# Altium schematic sheet Schematic QUO-Remote.schdoc
size 429 x 306 mm
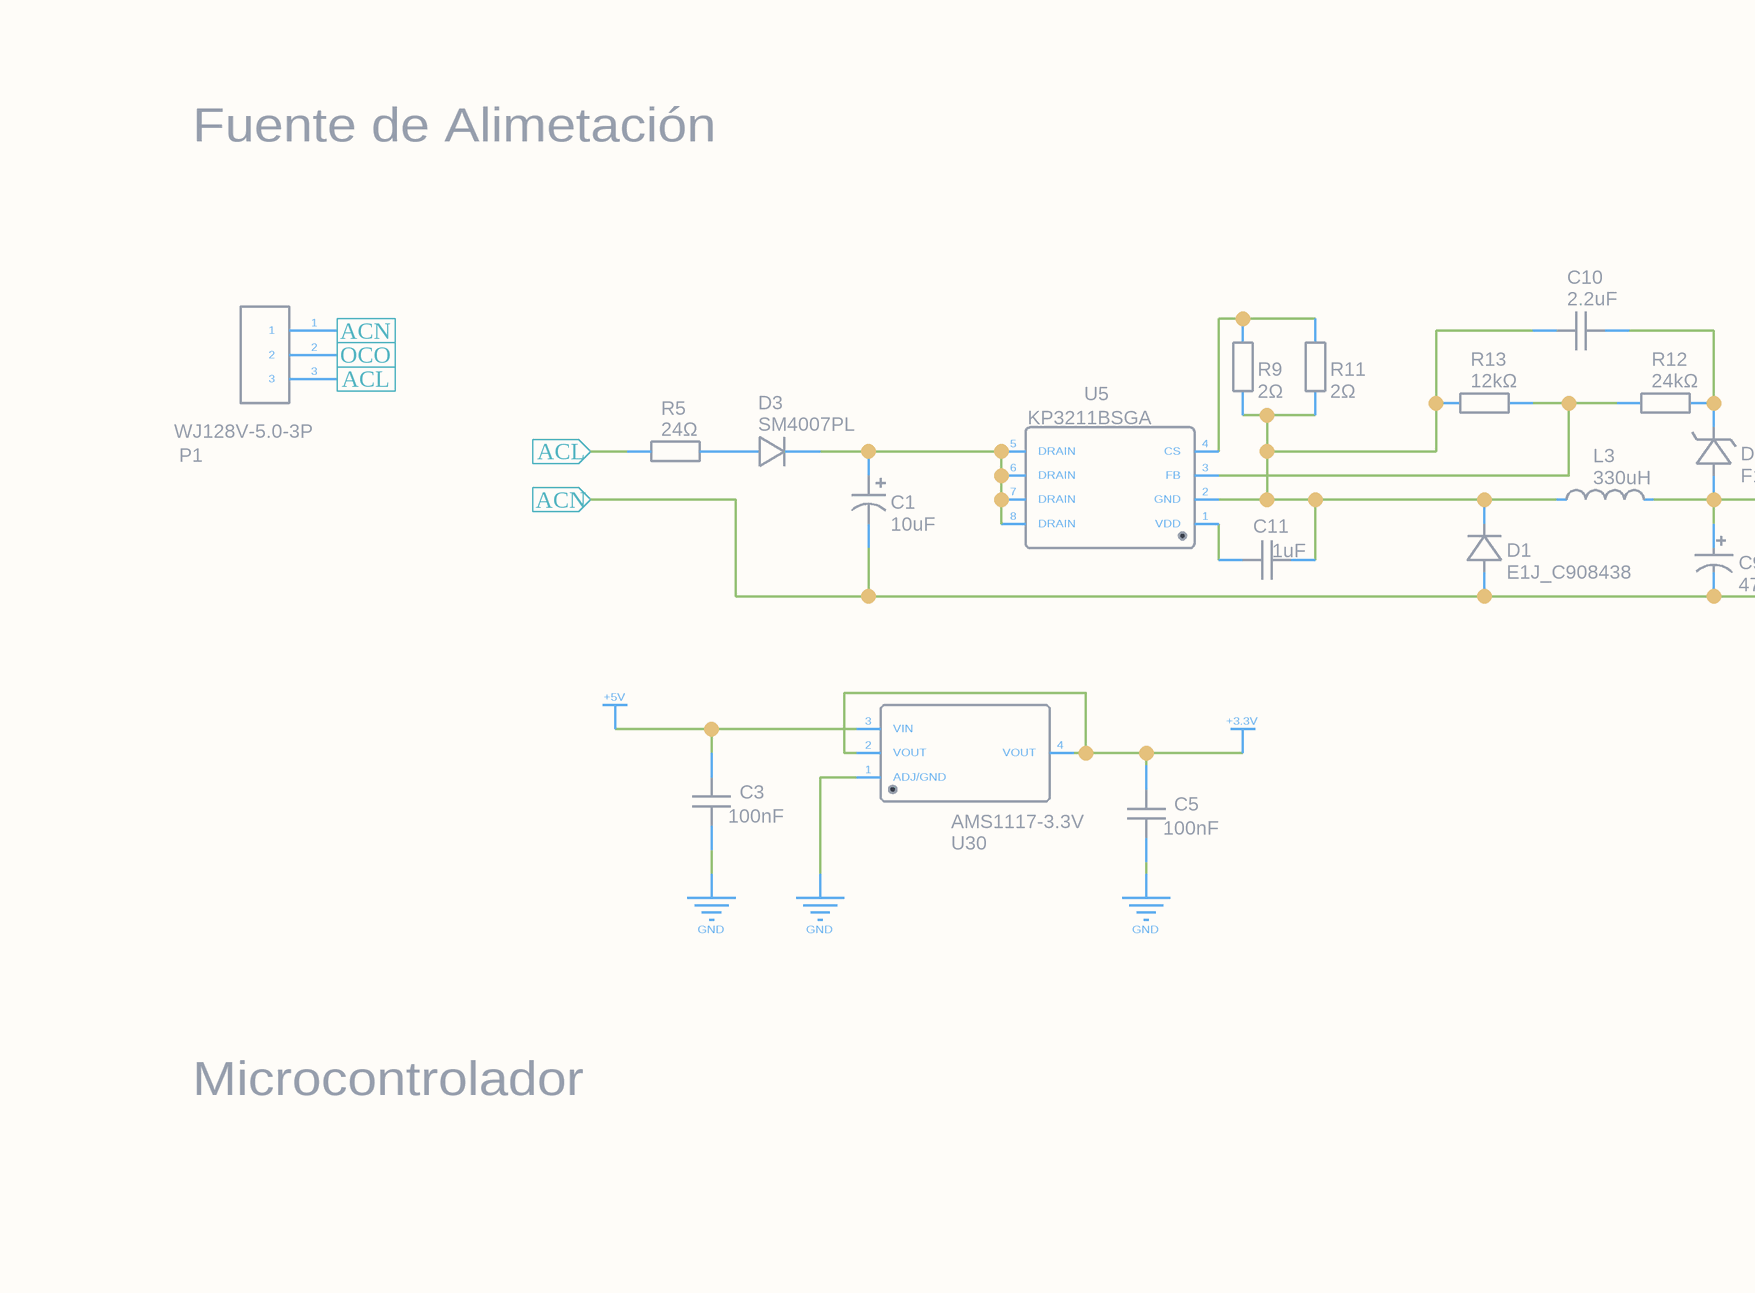
[diagram p0: Schematic QUO-Remote.schdoc, top left]
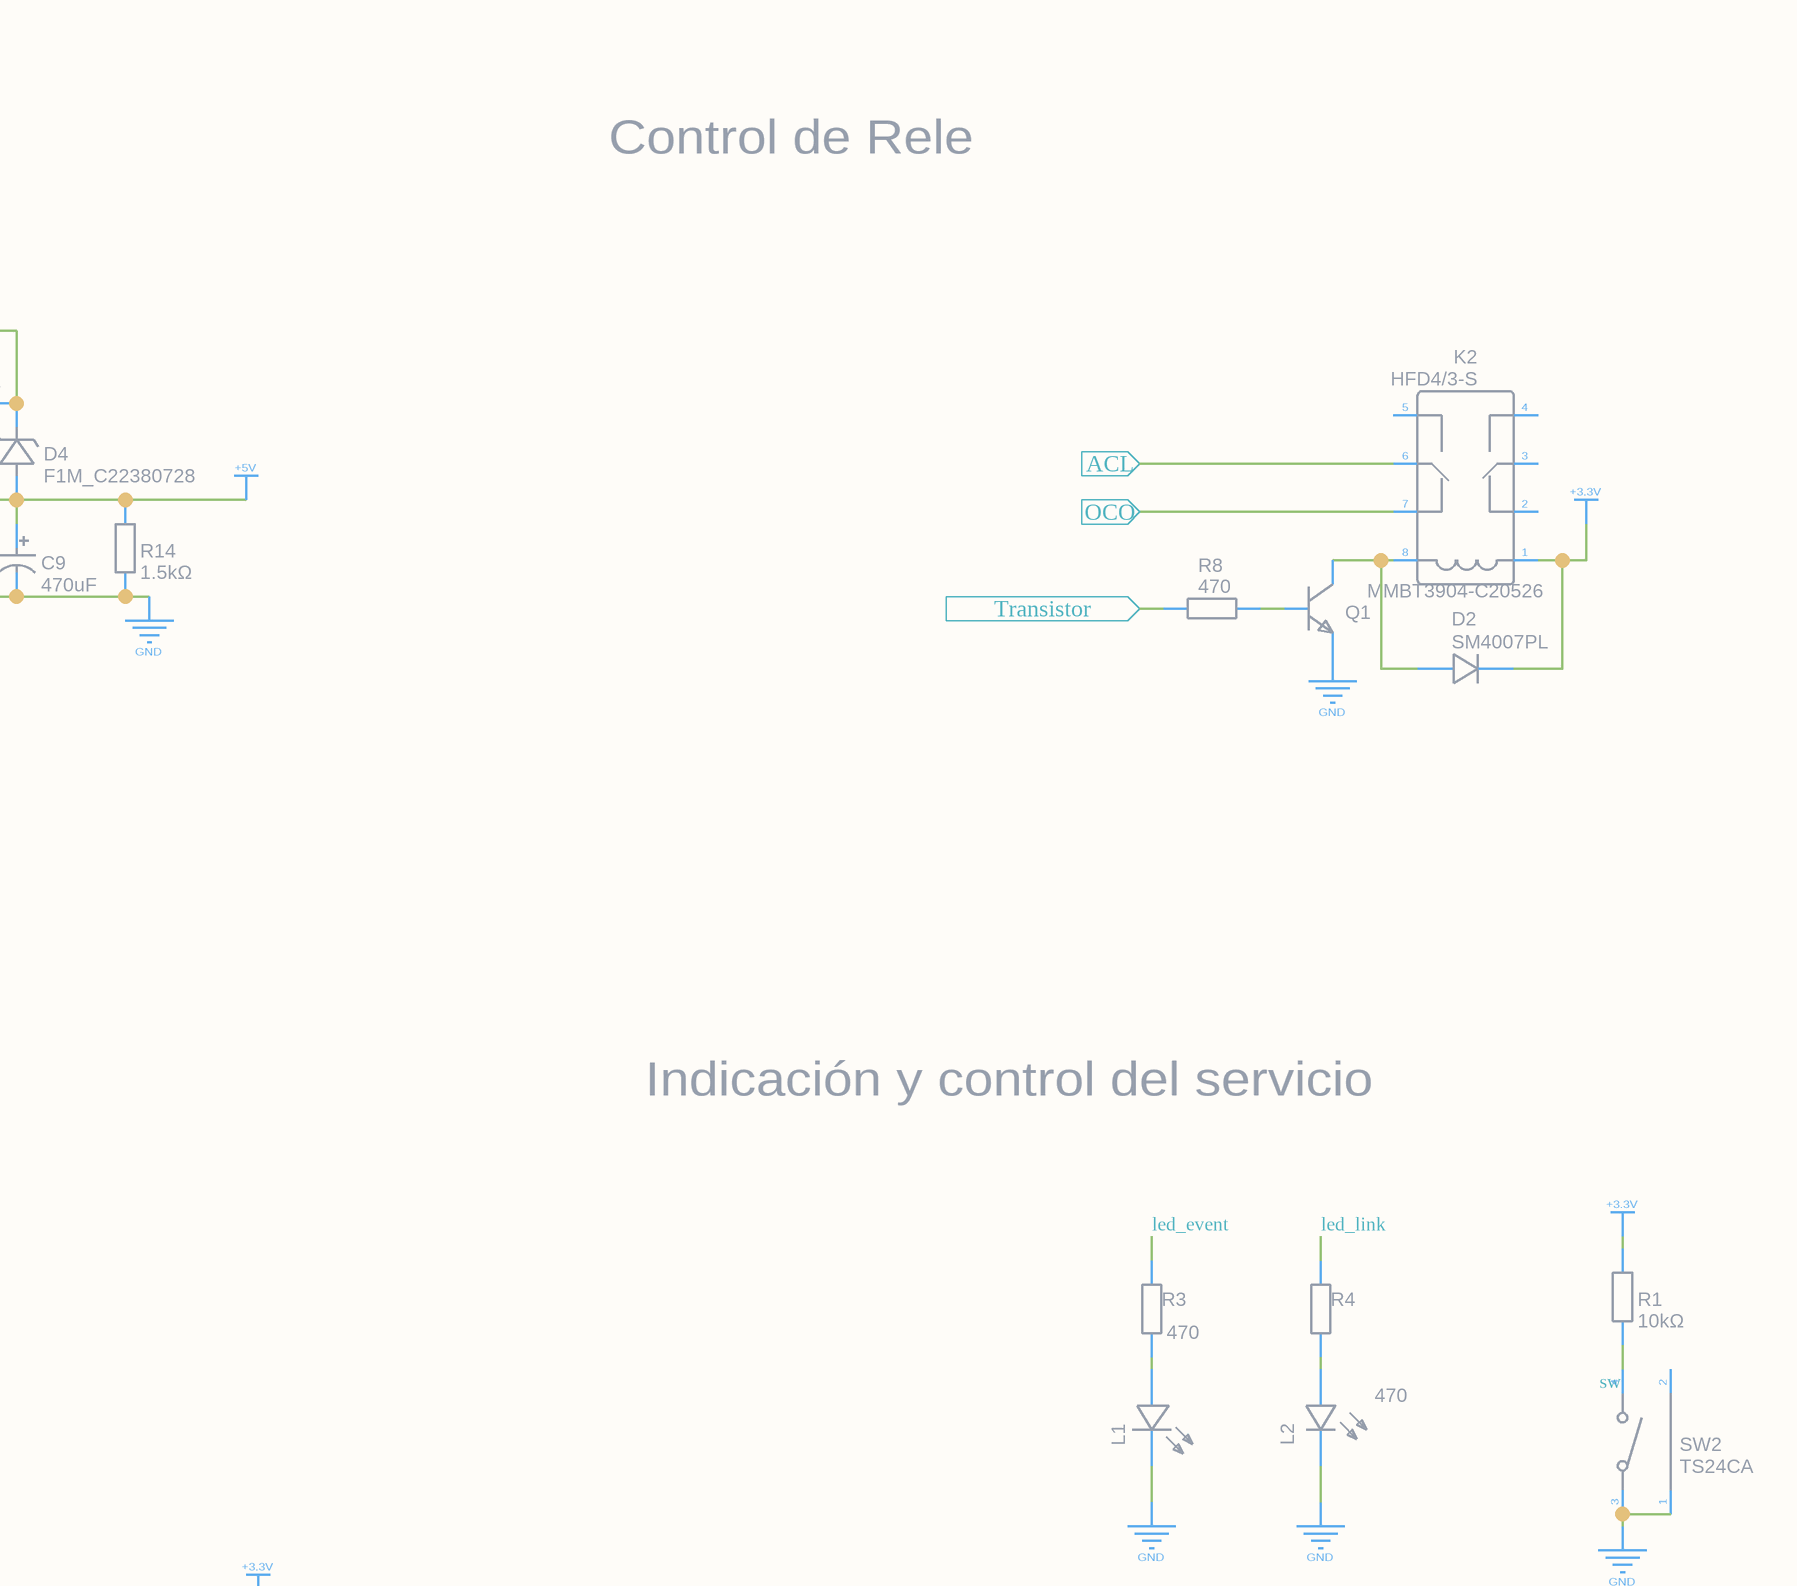
[diagram p1: Schematic QUO-Remote.schdoc, top middle]
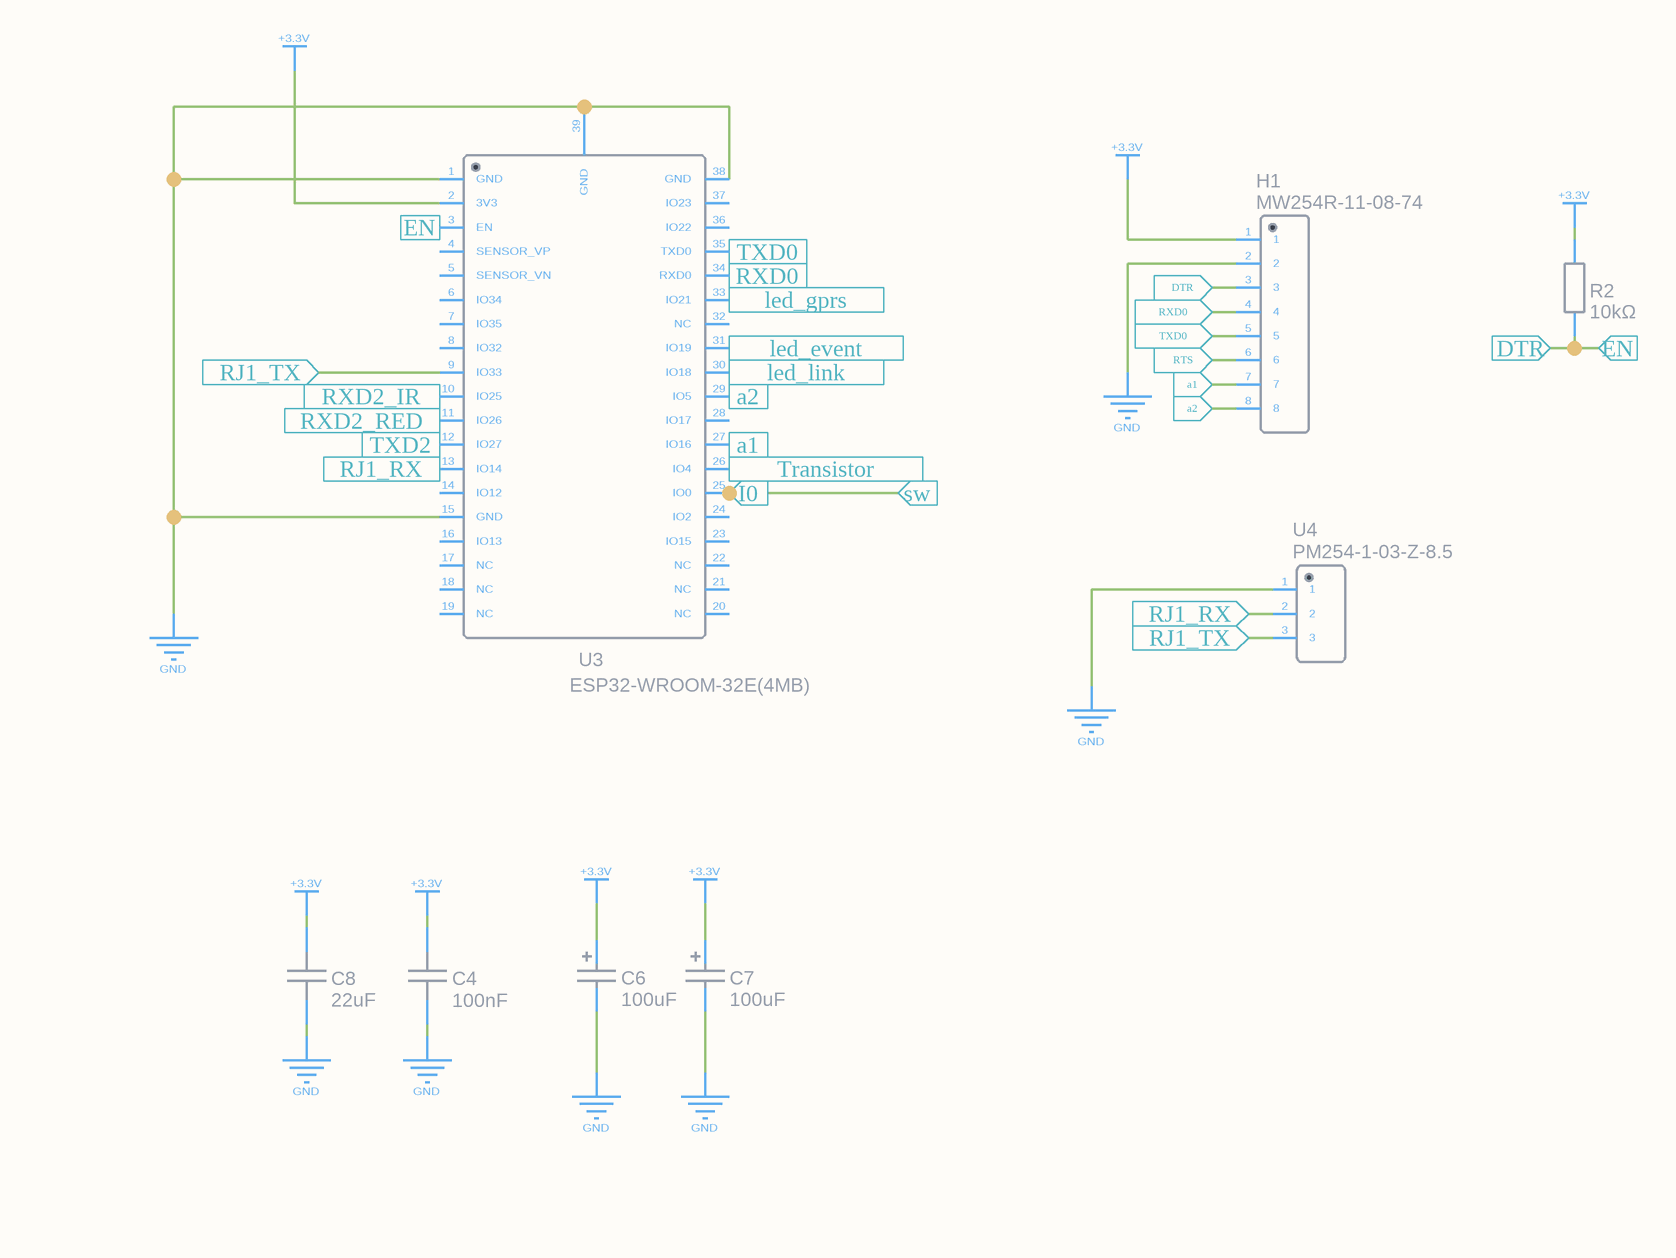
[diagram p2: Schematic QUO-Remote.schdoc, bottom left]
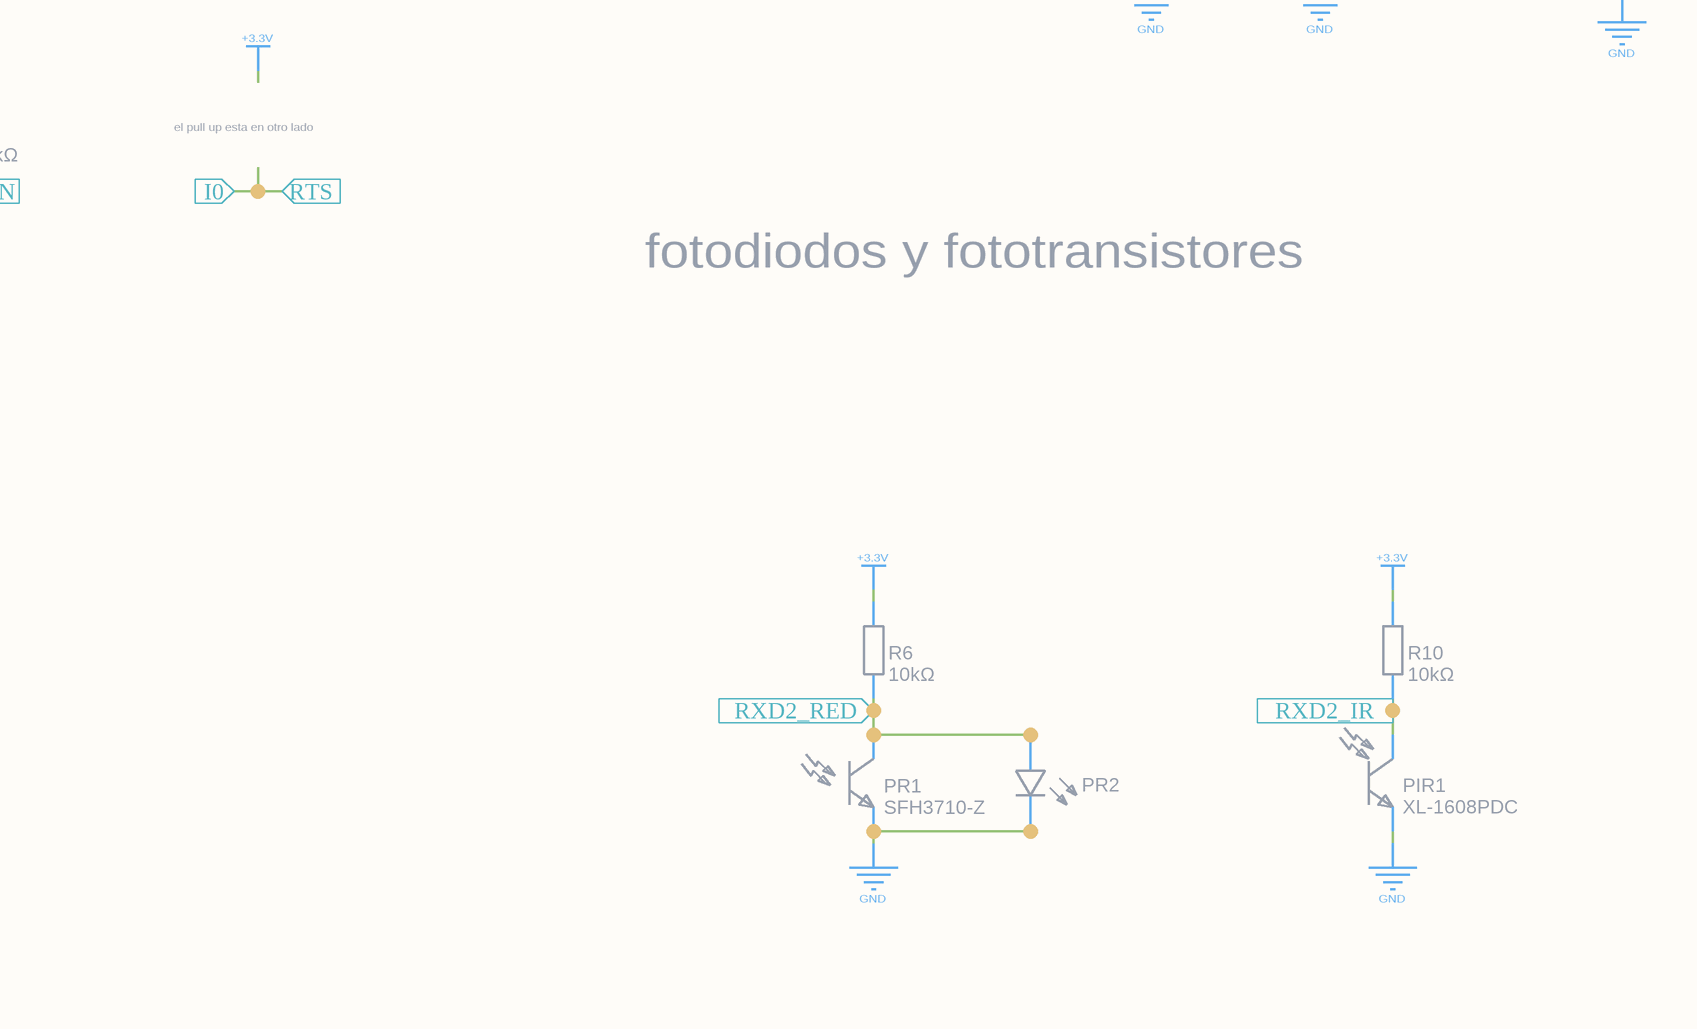
[diagram p3: Schematic QUO-Remote.schdoc, bottom middle]
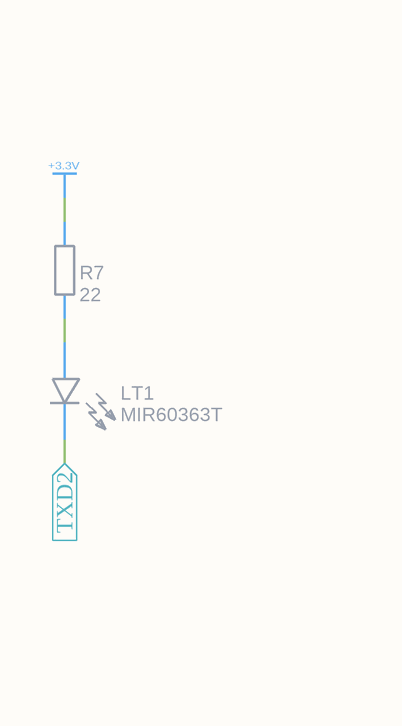
[diagram p4: Schematic QUO-Remote.schdoc, bottom right]

## Parts
C1  10uF  [CAP-TH_BD8.0-P3.50-D0.6-FD-2]
C3  100nF  [C0603]
C4  100nF  [C0603]
C5  100nF  [C0603]
C6  100uF  [CAP-SMD_L3.5-W2.8]
C7  100uF  [CAP-SMD_L3.5-W2.8]
C8  22uF  [C0603]
C9  470uF  [CAP-TH_BD8.0-P3.50-D0.6-FD]
C10  2.2uF  [C0805]
C11  1uF  [C1206]
D1  E1J_C908438  [SOD-123_L2.8-W1.8-LS3.7-RD]
D2  SM4007PL  [SOD-123F_L2.8-W1.8-LS3.7-RD]
D3  SM4007PL  [SOD-123F_L2.8-W1.8-LS3.7-RD]
D4  F1M_C22380728  [SOD-123FL_L2.7-W1.8-LS3.7-RD]
H1  MW254R-11-08-74  [HDR-TH_8P-P2.54-V-F-4]
K2  HFD4/3-S  [RELAY-SMD_HFD4-XX-SR]
L1  KT-0603R  [LED0603-R-RD]  (value not drawn)
L2  19-213/Y2C-CQ2R2L/3T(CY)  [LED0603-R-RD]  (value not drawn)
L3  330uH  [IND-TH_BD8.0-P5.00-D0.7]
LT1  MIR60363T  [LED0603-FD]
P1  WJ128V-5.0-3P  [CONN-TH_3P-P5.00_WJ128V-5.0-3P]
PIR1  XL-1608PDC  [SENSOR-SMD_L1.6-W0.8-XL-1608PDC]
PR1  SFH3710-Z  [OPTO-SMD_SFH3710-Z]
PR2  204-10SURD/S530-A3-L  [LED-TH_BD3.0-P2.54-FD]  (value not drawn)
Q1  MMBT3904-C20526  [SOT-23-3_L2.9-W1.3-P1.90-LS2.4-BR]
R1  10kΩ  [R0805]
R2  10kΩ  [R0805]
R3  470  [R0805]
R4  470  [R0805]
R5  24Ω  [R2512]
R6  10kΩ  [R0805]
R7  22  [R0805]
R8  470  [R0805]
R9  2Ω  [R1206]
R10  10kΩ  [R0805]
R11  2Ω  [R1206]
R12  24kΩ  [R0603]
R13  12kΩ  [R0603]
R14  1.5kΩ  [R0805]
SW2  TS24CA  [SW-SMD_TS24CA]
U3  ESP32-WROOM-32E(4MB)  [WIFI-SMD_ESP32-WROOM-32E]
U4  PM254-1-03-Z-8.5  [HDR-TH_3P-P2.54-V-F]
U5  KP3211BSGA  [SOIC-8_L4.9-W3.9-P1.27-LS6.0-BL]
U30  AMS1117-3.3V  [SOT-223-4_L6.5-W3.5-P2.30-LS7.0-BR]

## Blocks framed on the sheet
Fuente de Alimetación: C1 C3 C5 C9-C11 D1 D3 D4 L3 P1 R5 R9 R11-R14 U5 U30
Control de Rele: D2 K2 Q1 R8
Microcontrolador: C4 C6-C8 H1 R2 U3 U4
Indicación y control del servicio: L1 L2 R1 R3 R4 SW2

## Ports
a1 (in), a2 (in), ACL (in), ACN (in), DTR (in), EN (in), I0 (in), led_event (in), led_gprs (in), led_link (in), OCO (in), RJ1_RX (in), RJ1_TX (in), RTS (in), RXD0 (in), RXD2_IR (in), RXD2_RED (in), sw (in), Transistor (in), TXD0 (in), TXD2 (in)

## Nets
+3.3V: C4.2 C5.2 C6.1 C7.1 C8.2 D2.1(C) H1.1 K2.1 R1.2 R2.2 R6.2 R7.2 R10.2 U3.2(3V3) U30.2(VOUT) U30.4(VOUT)
+5V: C3.2 C9.1 D4.2(A) L3.2 R14.2 U30.3(VIN)
GND: C1.2 C3.1 C4.1 C5.1 C6.2 C7.2 C8.1 C9.2 D1.2(A) H1.2 L1.2(K) L2.2(C) P1.1 PIR1.2(E) PR1.1(E) PR2.2(K) Q1.2(E) R14.1 SW2.1 SW2.3 U3.1(GND) U3.15(GND) U3.38(GND) U3.39(GND) U4.1 U30.1(ADJ/GND) ; port ACN
a1: H1.7 U3.27(IO16) ; port a1
a2: H1.8 U3.29(IO5) ; port a2
ACL: K2.6 P1.3 R5.1 ; port ACL
DTR: H1.3 R2.1 U3.3(EN) ; port EN, port DTR
I0: H1.6 U3.25(IO0) ; port sw, port I0, port RTS
led_event: U3.31(IO19) ; port led_event
led_event: R3.1  [a separate net that carries the same name]
led_gprs: U3.33(IO21) ; port led_gprs
led_link: U3.30(IO18) ; port led_link
led_link: R4.1  [a separate net that carries the same name]
OCO: K2.7 P1.2 ; port OCO
RJ1_RX: U3.13(IO14) U4.2 ; port RJ1_RX
RJ1_TX: U3.9(IO33) U4.3 ; port RJ1_TX
RXD0: H1.4 U3.34(RXD0) ; port RXD0
RXD2_IR: PIR1.1(C) R10.1 U3.10(IO25) ; port RXD2_IR
RXD2_RED: PR1.2(C) PR2.1(A) R6.1 U3.11(IO26) ; port RXD2_RED
sw: R1.1 SW2.4
Transistor: R8.1 U3.26(IO4) ; port Transistor
TXD0: H1.5 U3.35(TXD0) ; port TXD0
TXD2: LT1.2(C) U3.12(IO27) ; port TXD2
NetC1_1: C1.1 D3.1(C) U5.5(DRAIN) U5.6(DRAIN) U5.7(DRAIN) U5.8(DRAIN)
NetC10_1: C10.1 D4.1(C) R12.2
NetC10_2: C10.2 C11.2 D1.1(K) L3.1 R9.1 R11.1 R13.1 U5.2(GND)
NetC11_1: C11.1 U5.1(VDD)
NetD2_2: D2.2(A) K2.8 Q1.3(C)
NetD3_2: D3.2(A) R5.2
NetL1_1: L1.1(A) R3.2
NetL2_1: L2.1(A) R4.2
NetLT1_1: LT1.1(A) R7.1
NetQ1_1: Q1.1(B) R8.2
NetR9_2: R9.2 R11.2 U5.4(CS)
NetR12_1: R12.1 R13.2 U5.3(FB)

Not connected (* = marked no-connect by the designer): K2 2 3 4 5; SW2 2; U3 4(SENSOR_VP) 5(SENSOR_VN) 6(IO34) 7(IO35) 8(IO32) 14(IO12) 16(IO13) 17(NC) 18(NC) 19(NC) 20(NC) 21(NC) 22(NC) 23(IO15) 24(IO2) 28(IO17) 32(NC) 36(IO22) 37(IO23)

## Notes on the sheet
- el pull up esta en otro lado
- fotodiodos y fototransistores

## Library data of the parts
C1 = 10uF: Manufacturer: HRK(鸿瑞凯电子); Manufacturer Part: 400V10uF CD110; nameAlias: Value; Contributor: lcsc; Supplier: LCSC; Supplier Part: C2960249; JLCPCB Part Class: Extended Part; spicePre: C; spiceSymbolName: 400V10UF CD110
C3 C5 = 100nF: Manufacturer: YAGEO; Manufacturer Part: CC0603KRX7R9BB104; nameAlias: Capacitance; SMT Type: Basic; Supplier: LCSC; LCSC Assembly: Yes; Supplier Part: C14663; spicePre: C; spiceSymbolName: CC0603KRX7R9BB104
C4 = 100nF: Manufacturer: YAGEO(国巨); Manufacturer Part: CC0603KRX7R9BB104; nameAlias: Value; Supplier: LCSC; Supplier Part: C14663; JLCPCB Part Class: Basic Part; spicePre: C; spiceSymbolName: CC0603KRX7R9BB104
C6 C7 = 100uF: Manufacturer: Kyocera AVX; Manufacturer Part: TAJB107K006RNJ; nameAlias: Capacitance; Supplier: LCSC; Supplier Part: C16133; JLCPCB Part Class: Basic Part; spicePre: C; spiceSymbolName: TAJB107K006RNJ
C8 = 22uF: Manufacturer: SAMSUNG(三星); Manufacturer Part: CL10A226MQ8NRNC; nameAlias: Capacitance; Supplier: LCSC; Supplier Part: C59461; JLCPCB Part Class: Basic Part; spicePre: C; spiceSymbolName: CL10A226MQ8NRNC
C9 = 470uF: Manufacturer: CX(承兴); Manufacturer Part: GR477M025F14RR0VL4FP0; nameAlias: Value; Supplier: LCSC; Supplier Part: C5154; JLCPCB Part Class: Extended Part; spicePre: C; spiceSymbolName: 470uF 25V Green high frequency
C10 = 2.2uF: Manufacturer: SAMSUNG(三星); Manufacturer Part: CL21A225KBQNNNE; nameAlias: Value; Contributor: LCSC; Supplier: LCSC; Supplier Part: C377773; JLCPCB Part Class: Basic Part; spicePre: C; spiceSymbolName: CL21A225KBQNNNE
C11 = 1uF: Manufacturer: SAMSUNG(三星); Manufacturer Part: CL31B105KBHNNNE; nameAlias: Value; Supplier: LCSC; Supplier Part: C1848; JLCPCB Part Class: Basic Part; spicePre: C; spiceSymbolName: CL31B105KBHNNNE
D1 = E1J_C908438: Manufacturer: GOODWORK(固得沃克); Manufacturer Part: E1J; Contributor: lcsc; Supplier: LCSC; Supplier Part: C908438; JLCPCB Part Class: Extended Part; spicePre: D; spiceSymbolName: E1J_C908438
D2 D3 = SM4007PL: Manufacturer: MDD(辰达半导体); Supplier: LCSC; Manufacturer Part: SM4007PL; Supplier Part: C64898; JLCPCB Part Class: Basic Part; spicePre: D; spiceSymbolName: SM4007PL
D4 = F1M_C22380728: Manufacturer: BORN(伯恩半导体); Manufacturer Part: F1M; Contributor: lcsc; Supplier: LCSC; Supplier Part: C22380728; JLCPCB Part Class: Extended Part; spicePre: D; spiceSymbolName: F1M_C22380728
H1 = MW254R-11-08-74: Manufacturer: DEALON(德艺隆); Contributor: lcsc; Supplier: LCSC; Supplier Part: C19191985; Manufacturer Part: MW254R-11-08-74; spicePre: U; spiceSymbolName: MW254R-11-08-74
K2 = HFD4/3-S: Manufacturer: HF(宏发); Manufacturer Part: HFD4/3-SR; Contributor: LCSC; Supplier: LCSC; Supplier Part: C90259; JLCPCB Part Class: Extended Part; spicePre: K; spiceSymbolName: HFD4/3-S
L1 = KT-0603R: Manufacturer: KENTO; Supplier: LCSC; Manufacturer Part: KT-0603R; Supplier Part: C2286; JLCPCB Part Class: Basic Part; spicePre: L; spiceSymbolName: KT-0603R
L2 = 19-213/Y2C-CQ2R2L/3T(CY): Manufacturer: EVERLIGHT; Supplier: LCSC; Manufacturer Part: 19-213/Y2C-CQ2R2L/3T(CY); Supplier Part: C72038; JLCPCB Part Class: Basic Part; spicePre: L; spiceSymbolName: 19-213/Y2C-CQ2R2L/3T(CY)
L3 = 330uH: Manufacturer: Sunltech(韩国顺磁); Manufacturer Part: SLP0810R-331KTT; nameAlias: Value; Contributor: lcsc; Supplier: LCSC; Supplier Part: C20623984; JLCPCB Part Class: Extended Part; spicePre: L; spiceSymbolName: SLP0810R-331KTT
LT1 = MIR60363T: Manufacturer: EVERLIGHT(亿光); Supplier: LCSC; Manufacturer Part: MIR60363T; Supplier Part: C50494; JLCPCB Part Class: Extended Part; spicePre: I; spiceSymbolName: MIR60363T
P1 = WJ128V-5.0-3P: Manufacturer: KANGNEX(康奈克斯电气); Supplier: LCSC; Manufacturer Part: WJ128V-5.0-3P; Supplier Part: C8270; JLCPCB Part Class: Extended Part; spicePre: P; spiceSymbolName: WJ128V-5.0-3P
PIR1 = XL-1608PDC: Manufacturer: XINGLIGHT(成兴光); Contributor: LCSC; Supplier: LCSC; Supplier Part: C965887; Manufacturer Part: XL-1608PDC; JLCPCB Part Class: Extended Part; spicePre: L; spiceSymbolName: XL-1608PDC
PR1 = SFH3710-Z: Manufacturer: OSRAM(欧司朗); Contributor: LCSC; Supplier: LCSC; Manufacturer Part: SFH3710-Z; Supplier Part: C129152; JLCPCB Part Class: Extended Part; spicePre: U; spiceSymbolName: SFH3710-Z
PR2 = 204-10SURD/S530-A3-L: Manufacturer: EVERLIGHT; Supplier: LCSC; Manufacturer Part: 204-10SURD/S530-A3-L; Supplier Part: C99771; spicePre: L; spiceSymbolName: 204-10SURD/S530-A3-L
Q1 = MMBT3904-C20526: Manufacturer: CJ; SMT Type: Basic; Contributor: 立创EDA官方封装库; Supplier: LCSC; Manufacturer Part: MMBT3904; Supplier Part: C20526; LCSC Assembly: Yes; spicePre: Q; spiceSymbolName: MMBT3904-C20526
R1 R2 R6 R10 = 10kΩ: Manufacturer: UNI-ROYAL(厚声); Manufacturer Part: 0805W8F1002T5E; nameAlias: Value; Supplier: LCSC; Supplier Part: C17414; JLCPCB Part Class: Basic Part; spicePre: R; spiceSymbolName: 0805W8F1002T5E
R3 R4 R8 = 470: Manufacturer: UniOhm; Manufacturer Part: 0805W8F4700T5E; nameAlias: Resistance (Ohms); SMT Type: Basic; Supplier: LCSC; LCSC Assembly: Yes; Supplier Part: C17710; spicePre: R; spiceSymbolName: 0805W8F4700T5E
R5 = 24Ω: Manufacturer: EVER OHMS(天二科技); Manufacturer Part: CRH2512F24R0E04Z; nameAlias: Value; Contributor: LCSC; Supplier: LCSC; Supplier Part: C175254; JLCPCB Part Class: Extended Part; spicePre: R; spiceSymbolName: CR2512F24RE042W
R7 = 22: Manufacturer: UniOhm; Manufacturer Part: 0805W8F220JT5E; nameAlias: Resistance (Ohms); SMT Type: Basic; Supplier: LCSC; Supplier Part: C17561; JLCPCB SMD: Yes; spicePre: R; spiceSymbolName: 0805W8F220JT5E
R9 R11 = 2Ω: Manufacturer: UNI-ROYAL(厚声); Manufacturer Part: 1206W4F200KT5E; nameAlias: Value; Supplier: LCSC; Supplier Part: C17942; JLCPCB Part Class: Extended Part; spicePre: R; spiceSymbolName: 1206W4F200KT5E
R12 = 24kΩ: Manufacturer: UNI-ROYAL(厚声); Manufacturer Part: 0603WAF2402T5E; nameAlias: Value; Supplier: LCSC; Supplier Part: C23352; JLCPCB Part Class: Basic Part; spicePre: R; spiceSymbolName: 0603WAF2402T5E
R13 = 12kΩ: Manufacturer: UNI-ROYAL(厚声); Manufacturer Part: 0603WAF1202T5E; nameAlias: Value; Supplier: LCSC; Supplier Part: C22790; JLCPCB Part Class: Basic Part; spicePre: R; spiceSymbolName: 0603WAF1202T5E
R14 = 1.5kΩ: Manufacturer: UNI-ROYAL(厚声); Manufacturer Part: 0805W8F1501T5E; nameAlias: Value; Supplier: LCSC; Supplier Part: C4310; JLCPCB Part Class: Basic Part; spicePre: R; spiceSymbolName: 0805W8F1501T5E
SW2 = TS24CA: Manufacturer: SHOU HAN(首韩); Contributor: LCSC; Supplier: LCSC; Supplier Part: C393942; Manufacturer Part: TS24CA; JLCPCB Part Class: Extended Part; spicePre: S; spiceSymbolName: TS24CA
U3 = ESP32-WROOM-32E(4MB): Manufacturer: ESPRESSIF(乐鑫); Manufacturer Part: ESP32-WROOM-32E-N4; Contributor: LCSC; Supplier: LCSC; Supplier Part: C701341; JLCPCB Part Class: Extended Part; spicePre: U; spiceSymbolName: ESP32-WROOM-32E(4MB)
U4 = PM254-1-03-Z-8.5: Manufacturer: HCTL(华灿天禄); Contributor: LCSC; Supplier: LCSC; Supplier Part: C2897366; Manufacturer Part: PM254-1-03-Z-8.5; JLCPCB Part Class: Extended Part; spicePre: U; spiceSymbolName: PM254-1-03-Z-8.5
U5 = KP3211BSGA: Manufacturer: Kiwi Instruments(必易微); Contributor: lcsc; Supplier: LCSC; Supplier Part: C2692543; Manufacturer Part: KP3211BSGA; JLCPCB Part Class: Extended Part; spicePre: U; spiceSymbolName: KP3211BSGA
U30 = AMS1117-3.3V: Manufacturer: WPMtek(维攀微); Contributor: LCSC; Supplier: LCSC; Supplier Part: C2688239; Manufacturer Part: AMS1117-3.3V; JLCPCB Part Class: Extended Part; spicePre: U; spiceSymbolName: AMS1117-3.3V